# EAGLE design RPM_TFT2 (EAGLE 6.4)
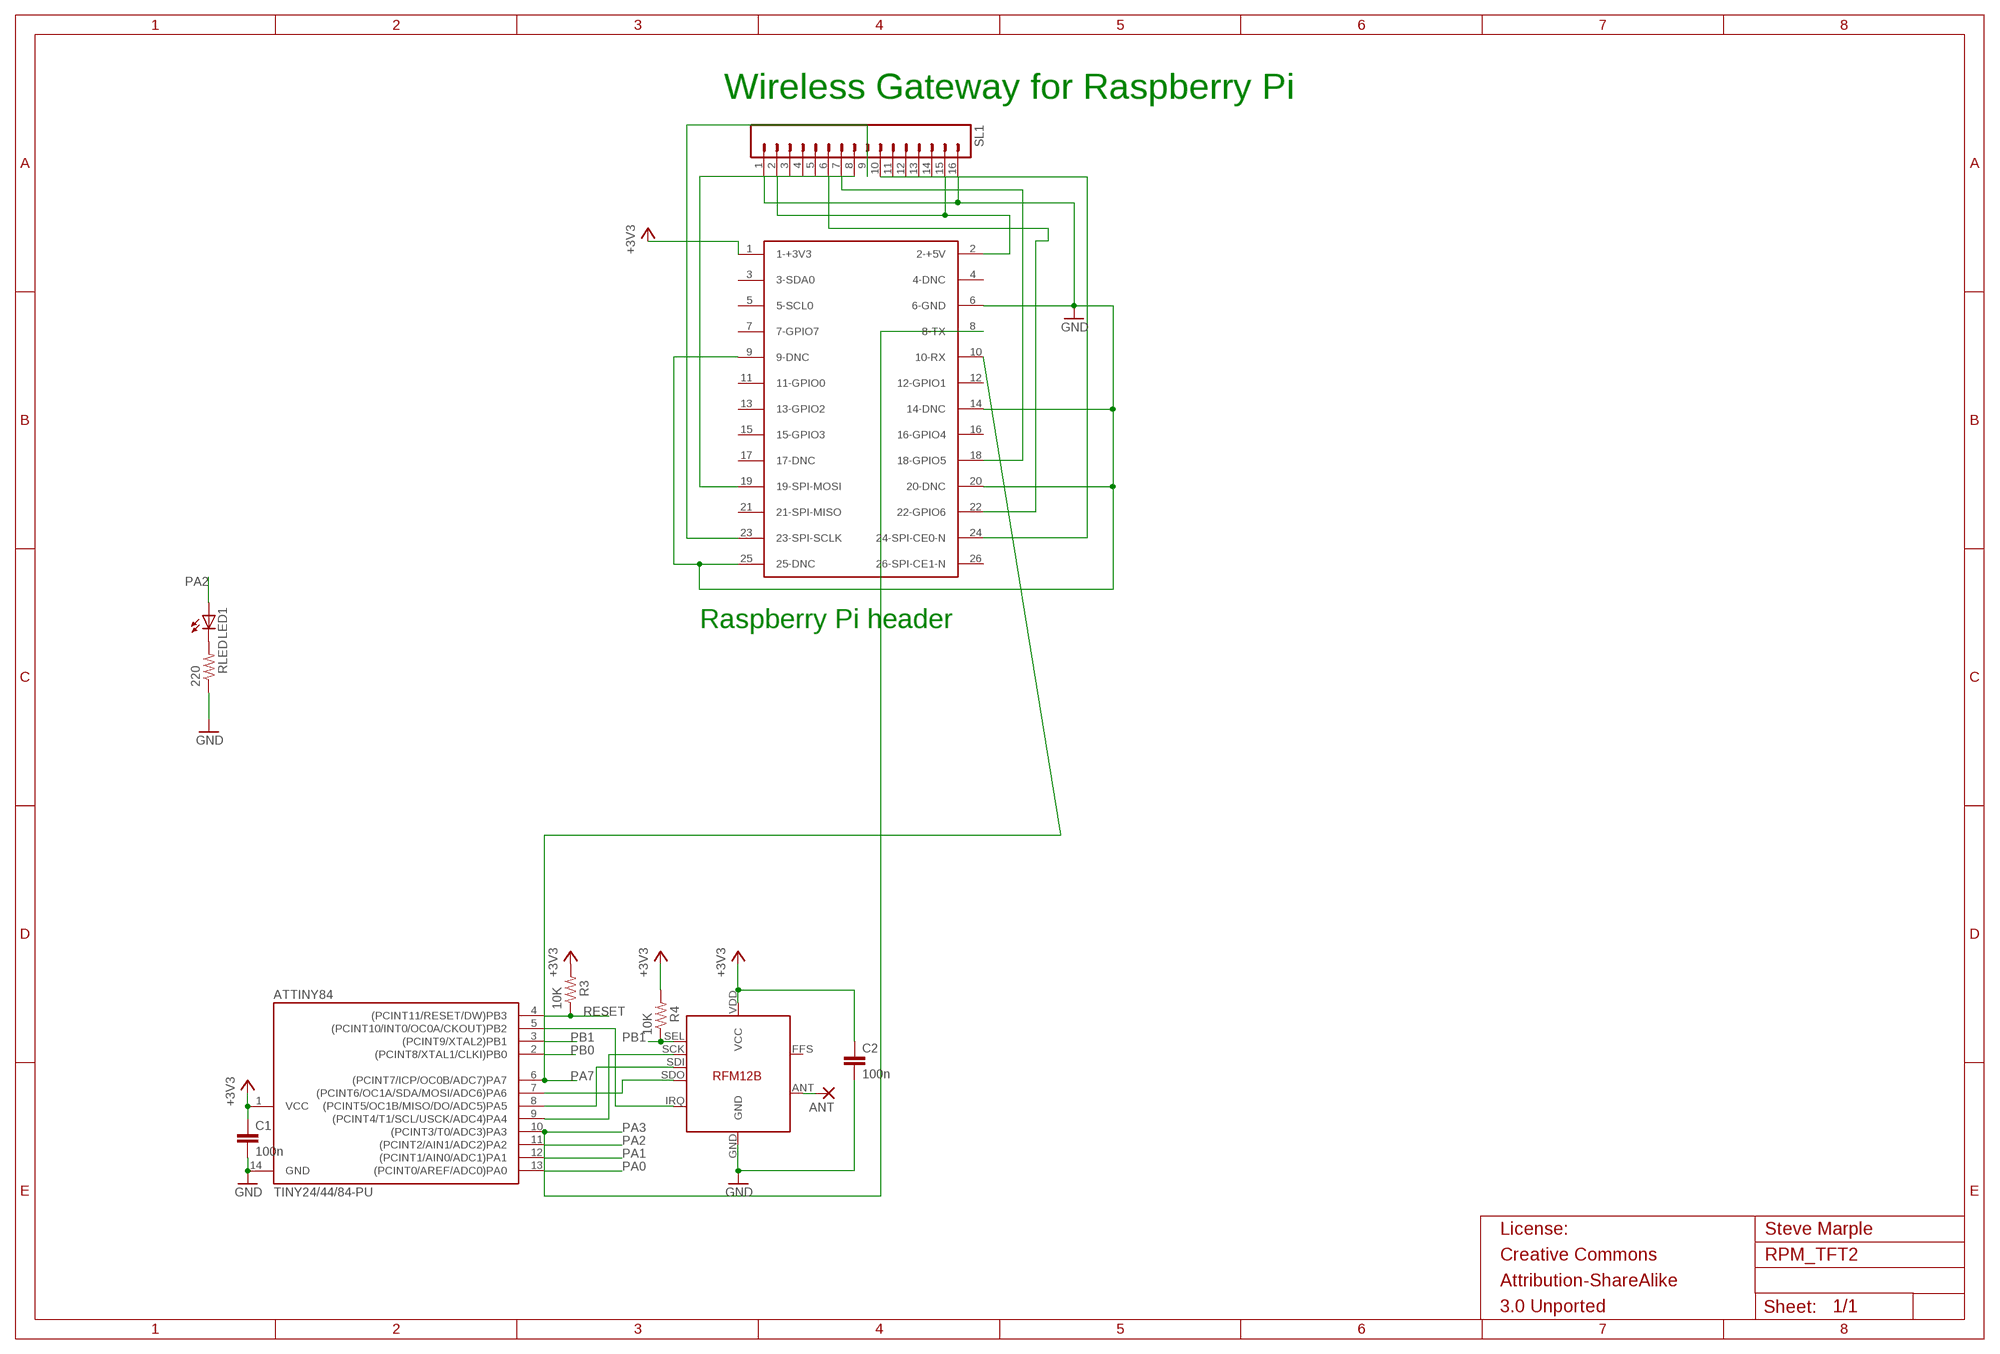
[diagram p0: schematic, sheet 1]

## Parts
ANT  1,6/0,8  [1,6/0,8]
ATTINY84  TINY24/44/84-PU  [DIL14]
C1  100n  C-EU025-024X044  [C025-024X044]
C2  100n  C-EU025-024X044  [C025-024X044]
LED1  LED5MM  [LED5MM]
R3  10K  RESISTORAXIAL-0.3  [AXIAL-0.3]
R4  10K  RESISTORAXIAL-0.3  [AXIAL-0.3]
RFM12B  RFM12B  [RFM12B]
RLED  220  RESISTORAXIAL-0.3  [AXIAL-0.3]
SL1  M16  [16P]
X1  P1A  RASPBERRY-PIHEADER  [RASPBERRY-PI-HEADER]

## Nets
+3V3 [power]: ATTINY84.1(VCC) C1.1 C2.1 R3.P$2 R4.P$2 RFM12B.VDD(VCC) X1.1(1-+3V3)
GND [power]: ATTINY84.14(GND) C1.2 C2.2 RFM12B.GND RLED.P$1 SL1.1 SL1.16 X1.6(6-GND) X1.9(9-DNC) X1.14(14-DNC) X1.20(20-DNC) X1.25(25-DNC)
MISO: ATTINY84.8((PCINT5/OC1B/MISO/DO/ADC5)PA5) RFM12B.SDI
MOSI: ATTINY84.7((PCINT6/OC1A/SDA/MOSI/ADC6)PA6) RFM12B.SDO
N$2: SL1.6 X1.22(22-GPIO6)
N$3: LED1.K(C) RLED.P$2
N$4: SL1.2 SL1.15 X1.2(2-+5V)
N$5: SL1.7 X1.18(18-GPIO5)
N$6 [power]: ANT.1(P) RFM12B.ANT
N$7: SL1.8 X1.19(19-SPI-MOSI)
N$8: SL1.9 X1.23(23-SPI-SCLK)
N$9: SL1.10 X1.24(24-SPI-CE0-N)
PA0: ATTINY84.13((PCINT0/AREF/ADC0)PA0)
PA1 [power]: ATTINY84.12((PCINT1/AIN0/ADC1)PA1)
PA2: ATTINY84.11((PCINT2/AIN1/ADC2)PA2) LED1.A
PA3: ATTINY84.10((PCINT3/T0/ADC3)PA3) X1.8(8-TX)
PA7: ATTINY84.6((PCINT7/ICP/OC0B/ADC7)PA7) X1.10(10-RX)
PB0: ATTINY84.2((PCINT8/XTAL1/CLKI)PB0)
PB1: ATTINY84.3((PCINT9/XTAL2)PB1) R4.P$1 RFM12B.SEL
PB2: ATTINY84.5((PCINT10/INT0/OC0A/CKOUT)PB2) RFM12B.IRQ
RESET: ATTINY84.4((PCINT11/RESET/DW)PB3) R3.P$1
SCK: ATTINY84.9((PCINT4/T1/SCL/USCK/ADC4)PA4) RFM12B.SCK
Unconnected: RFM12B.FFS SL1.3 SL1.4 SL1.5 SL1.11 SL1.12 SL1.13 SL1.14 X1.3(3-SDA0) X1.4(4-DNC) X1.5(5-SCL0) X1.7(7-GPIO7) X1.11(11-GPIO0) X1.12(12-GPIO1) X1.13(13-GPIO2) X1.15(15-GPIO3) X1.16(16-GPIO4) X1.17(17-DNC) X1.21(21-SPI-MISO) X1.26(26-SPI-CE1-N)

## Notes on the sheet
- Wireless Gateway for Raspberry Pi
- Raspberry Pi header
- License: | Steve Marple
- Creative Commons
- Attribution-ShareAlike
- 3.0 Unported

## Library data of the parts
ANT = JeeLabs:1,6/0,8: THROUGH-HOLE PAD
ATTINY84 = avr-7:TINY24/44/84
C1 C2 = rcl:C-EU: CAPACITOR, European symbol
LED1 = led:LED: LED OSRAM: - CHIPLED LG R971, LG N971, LY N971, LG Q971, LY Q971, LO R971, LY R971 LH N974, LH R974 LS Q976, LO Q976, LY Q976 LO Q996 - Hyper CHIPLED LW Q18S LB Q993, LB Q99A, LB R99A - SideLED LS A670, LO A670, LY A670, LG A670, LP A670 LB A673, LV A673, LT A673, LW A673 LH A674 LY A675 LS A676, LA A676, LO A676, LY A676, LW A676 LS A679, LY A679, LG A679 - Hyper Micro SIDELED® LS Y876, LA Y876, LO Y876, LY Y876 LT Y87S - SmartLED LW L88C, LW L88S LB L89C, LB L89S, LG L890 LS L89K, LO L89K, LY L89K LS L896, LA L896, LO L896, LY L896 - TOPLED LS T670, LO T670, LY T670, LG T670, LP T670 LSG T670, LSP T670, LSY T670, LOP T670, LYG T670 LG T671, LOG T671, LSG T671 LB T673, LV T673, LT T673, LW T673 LH T674 LS T676, LA T676, LO T676, LY T676, LB T676, LH T676, LSB T676, LW T676 LB T67C, LV T67C, LT T67C, LS T67K, LO T67K, LY T67K, LW E67C LS E67B, LA E67B, LO E67B, LY E67B, LB E67C, LV E67C, LT E67C LW T67C LS T679, LY T679, LG T679 LS T770, LO T770, LY T770, LG T770, LP T770 LB T773, LV T773, LT T773, LW T773 LH T774 LS E675, LA E675, LY E675, LS T675 LS T776, LA T776, LO T776, LY T776, LB T776 LHGB T686 LT T68C, LB T68C - Hyper Mini TOPLED® LB M676 - Mini TOPLED Santana® LG M470 LS M47K, LO M47K, LY M47K Source: http://www.osram.convergy.de LUXEON: - LUMILED® LXK2-PW12-R00, LXK2-PW12-S00, LXK2-PW14-U00, LXK2-PW14-V00 LXK2-PM12-R00, LXK2-PM12-S00, LXK2-PM14-U00 LXK2-PE12-Q00, LXK2-PE12-R00, LXK2-PE12-S00, LXK2-PE14-T00, LXK2-PE14-U00 LXK2-PB12-K00, LXK2-PB12-L00, LXK2-PB12-M00, LXK2-PB14-N00, LXK2-PB14-P00, LXK2-PB14-Q00 LXK2-PR12-L00, LXK2-PR12-M00, LXK2-PR14-Q00, LXK2-PR14-R00 LXK2-PD12-Q00, LXK2-PD12-R00, LXK2-PD12-S00 LXK2-PH12-R00, LXK2-PH12-S00 LXK2-PL12-P00, LXK2-PL12-Q00, LXK2-PL12-R00 Source: www.luxeon.com KINGBRIGHT: KA-3528ASYC Source: www.kingbright.com
R3 R4 RLED = SparkFun:RESISTOR: Resistor Basic schematic elements and footprints for 0603, 1206, and PTH resistors.
RFM12B = JeeLabs:RFM12B
SL1 = con-amp-quick:M16: AMP QUICK CONNECTOR; OC_FARNELL: unknown; OC_NEWARK: unknown
X1 = SteveMarple:RASPBERRY-PI: Raspberry Pi Board <http://www.raspberrypi.org/> Jacques Lagnel V1.0 (beta) 2012 Board dimension: Forum 3D model <http://www.raspberrypi.org/forum/general-discussion/mechanical-profile-3d-models?value=3d%20model&type=1&include=1&search=1&ret=all> The GPIO Connector (P1): http://elinux.org/RPi_Low-level_peripherals

## Net classes
0 default: width 0.254 mm, drill 0.254 mm, clearance 0.254 mm
1 power: width 0.305 mm, drill 0.305 mm, clearance 0.305 mm
2 5V: width 0.381 mm
3 antenna: width 0.61 mm

## Board
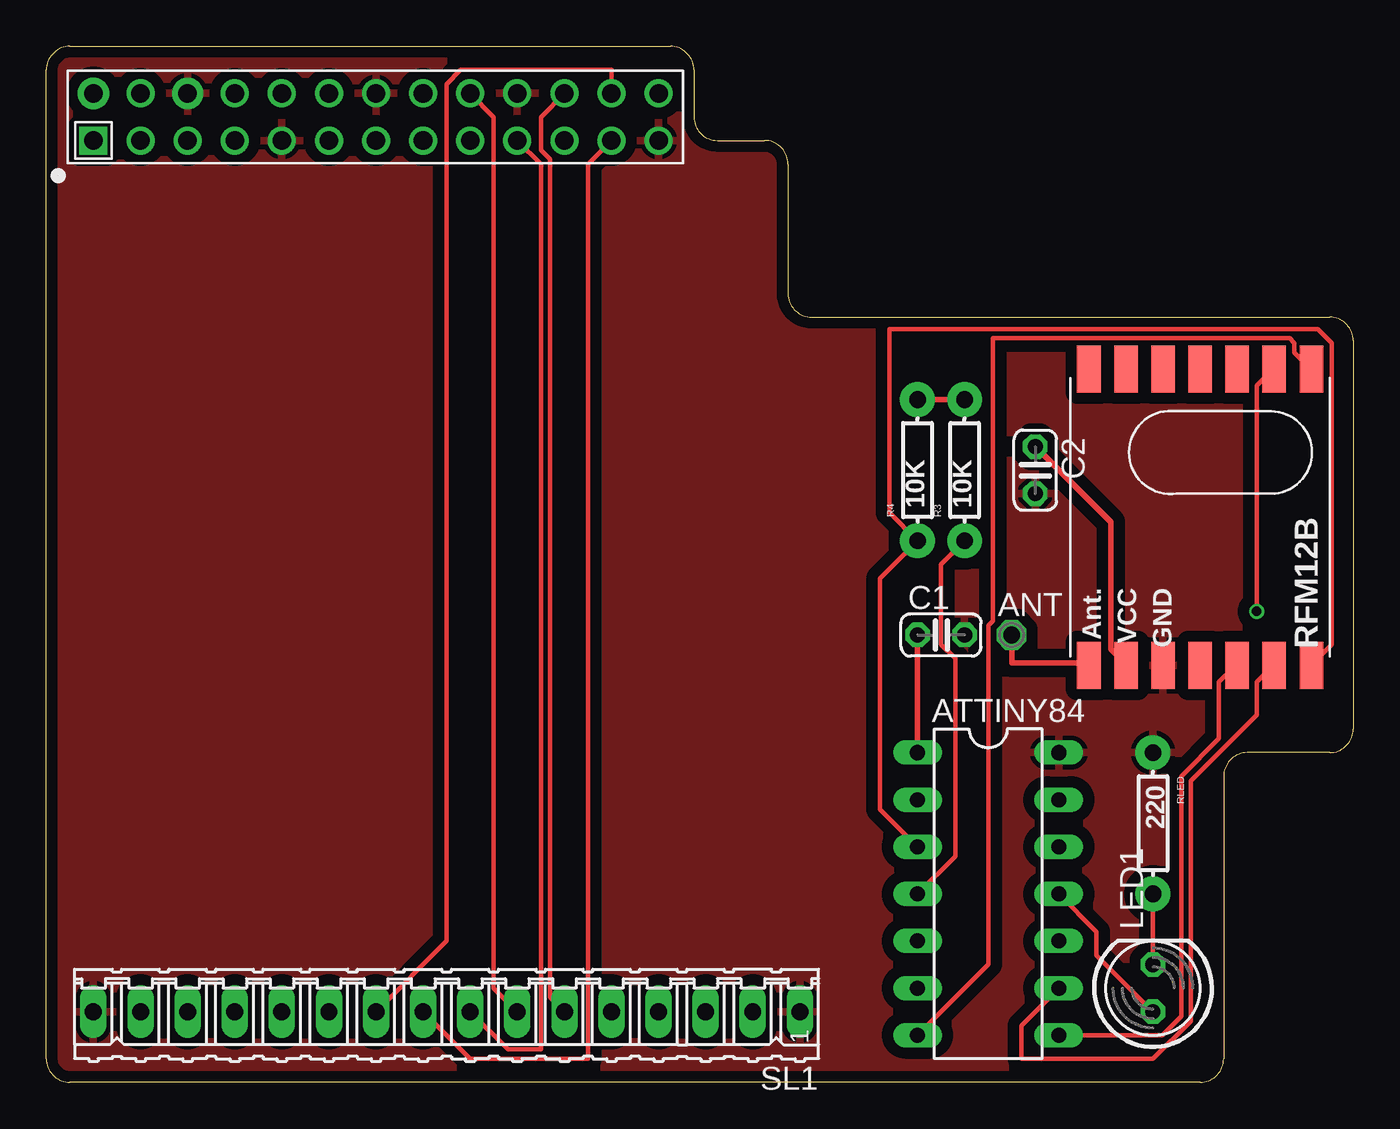
[diagram p1: board, top side]
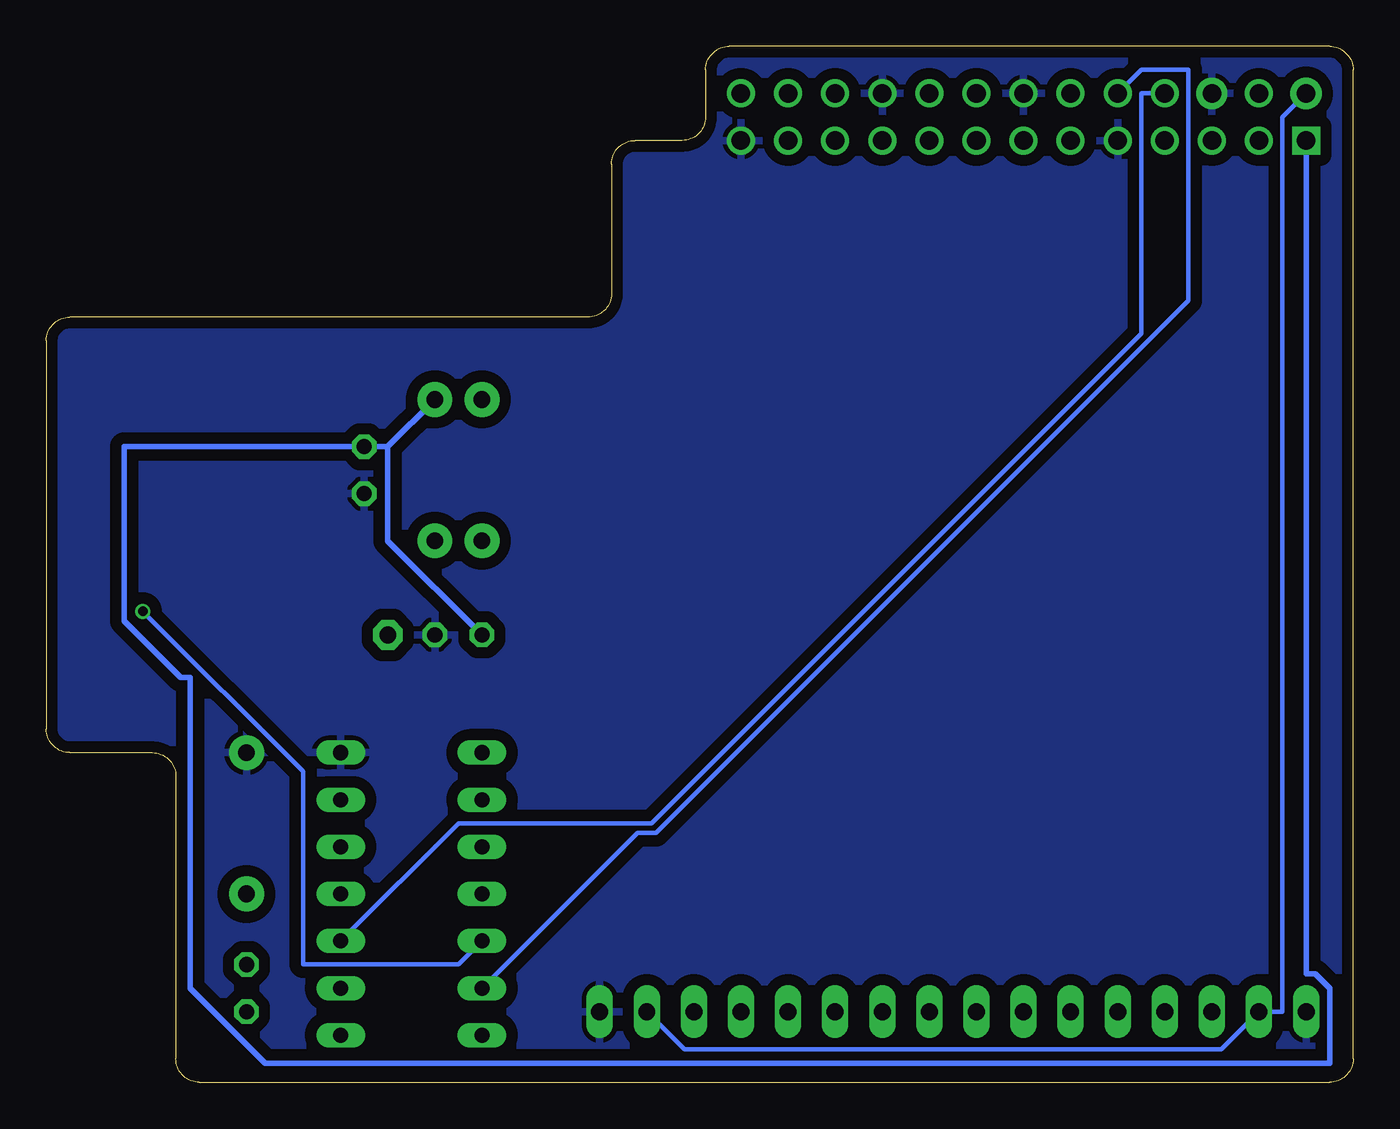
[diagram p2: board, bottom side, seen from below]

Size 70.48 x 55.88 mm. Coordinates in mm from the lower left corner, seen from the top.
Outline: 0,1.27 0,54.61 arc-90 1.27,55.88 33.66,55.88 arc-90 34.92,54.61 34.92,52.07 arc90 36.2,50.8 38.73,50.8 arc-90 40.01,49.53 40.01,42.55 arc90 41.27,41.27 69.22,41.27 arc-90 70.48,40.01 70.48,19.05 arc-90 69.22,17.78 64.77,17.78 arc90 63.5,16.51 63.5,1.27 arc-90 62.23,0 1.27,0 arc-90 0,1.27
Copper layers (1*16): Top 0.035mm / dielectric 1.5mm / Bottom 0.035mm
Design rules "EagleRules": minimum track width 7mil, minimum drill 12mil, track to track 7mil, track to pad 7mil, pad to pad 7mil, via to via 7mil, smd to smd 0mil, copper to edge 20mil, drill to drill 10mil, minimum pad ring 10mil, minimum via ring 6mil, stop-mask expansion 2mil, vias tented up to drill 25mil, thermal gap 10mil

### Footprints (pad centres in the part's own frame; a part is rotated, then mirrored left to right if it is on the bottom)
1,6/0,8 = drill 0.9 pad 1.6 octagon: 1 0,0
DIL14 = drill 0.813 long: 1 -7.62,-3.81; 2 -5.08,-3.81; 3 -2.54,-3.81; 4 0,-3.81; 5 2.54,-3.81; 6 5.08,-3.81; 7 7.62,-3.81; 8 7.62,3.81; 9 5.08,3.81; 10 2.54,3.81; 11 0,3.81; 12 -2.54,3.81; 13 -5.08,3.81; 14 -7.62,3.81
C025-024X044 = drill 0.813 octagon: 1 -1.27,0; 2 1.27,0
LED5MM = drill 0.813 octagon: A -1.27,0; K 1.27,0
AXIAL-0.3 = drill 0.9 pad 1.88: P$1 -3.81,0; P$2 3.81,0
RFM12B = smd 2.54 x 1.27: ANT 8,-6; FFS -8,2; GND 8,-2; IRQ -8,4; P$8 -8,0; P$9 -8,-2; P$10 -8,-4; P$12 -8,-6; P$16 8,0; SCK 8,4; SDI 8,2; SDO -8,6; SEL 8,6; VDD 8,-4
16P = drill 0.914 long: 1 -19.05,0; 2 -16.51,0; 3 -13.97,0; 4 -11.43,0; 5 -8.89,0; 6 -6.35,0; 7 -3.81,0; 8 -1.27,0; 9 1.27,0; 10 3.81,0; 11 6.35,0; 12 8.89,0; 13 11.43,0; 14 13.97,0; 15 16.51,0; 16 19.05,0
RASPBERRY-PI-HEADER = drill 1 square: 1 0,0 | drill 1 pad 1.676: 2 0,2.54; 6 5.08,2.54 | drill 1: 3 2.54,0; 4 2.54,2.54; 5 5.08,0; 7 7.62,0; 8 7.62,2.54; 9 10.16,0; 10 10.16,2.54; 11 12.7,0; 12 12.7,2.54; 13 15.24,0; 14 15.24,2.54; 15 17.78,0; 16 17.78,2.54; 17 20.32,0; 18 20.32,2.54; 19 22.86,0; 20 22.86,2.54; 21 25.4,0; 22 25.4,2.54; 23 27.94,0; 24 27.94,2.54; 25 30.48,0; 26 30.48,2.54

### Placement (x,y rotation side)
ANT  52.07,24.13 0 top
ATTINY84  50.8,10.16 270 top
C1  48.26,24.13 0 top
C2  53.34,33.02 270 top
LED1  59.69,5.08 90 top
R3  49.53,33.02 90 top
R4  46.99,33.02 90 top
RFM12B  62.23,30.48 270 top
RLED  59.69,13.97 270 top
SL1  21.59,3.81 180 top
X1  2.54,50.8 0 top

### Tracks (layer width: path | path; a pad name or v marks a point on that pad's centre or on a via)
+3V3
  Top 0.305: C1.1 ATTINY84.1 | R3.P$2 R4.P$2 | C2.1 57.4,30.23 57.4,23.37 58.17,22.61 RFM12B.VDD
  Bottom 0.305: X1.1 2.54,5.84 2.03,5.84 1.27,5.08 1.27,1.02 58.67,1.02 62.74,5.08 62.74,21.84 63.25,21.84 66.29,24.89 66.29,34.29 C2.1 52.07,34.29 | 52.07,34.29 R3.P$2 | C1.1 52.07,29.21 52.07,34.29
GND
  pour Bottom (isolate 0.61): -1.27,-1.27 -1.27,57.15 72.39,57.15 72.39,-1.27
  pour Top (isolate 0.61): -1.27,-1.27 -1.27,57.15 72.39,57.15 72.39,-1.27
MISO
  Top 0.254: ATTINY84.8 60.2,2.54 61.21,3.56 61.21,16.51 63.25,18.54 63.25,21.59 64.01,22.35 RFM12B.SDI
MOSI
  Top 0.254: ATTINY84.7 50.8,6.35 50.8,24.64 51.05,24.89 51.05,40.13 67.06,40.13 67.31,39.88 67.31,39.37 68.07,38.61 RFM12B.SDO
N$2
  Top 0.254: SL1.6 27.18,4.57 27.18,49.78 26.67,50.29 26.67,52.07 X1.22
N$3
  Top 0.254: RLED.P$2 LED1.K
N$4
  Bottom 0.254: SL1.2 36.07,1.78 7.11,1.78 SL1.15 3.81,3.81 3.81,52.07 X1.2
N$5
  Top 0.254: SL1.7 24.13,5.08 24.13,52.07 X1.18
N$6
  Top 0.305: ANT.1 52.07,22.61 56.13,22.61 RFM12B.ANT
N$7
  Top 0.254: SL1.8 24.89,1.78 26.67,1.78 26.67,49.53 X1.19
N$8
  Top 0.254: SL1.9 22.86,1.27 29.21,1.27 29.21,49.53 X1.23
N$9
  Top 0.254: SL1.10 21.59,7.62 21.59,53.85 22.35,54.61 30.48,54.61 X1.24
PA2
  Top 0.254: LED1.A 56.64,6.86 56.64,8.13 ATTINY84.11
PA3
  Bottom 0.254: ATTINY84.10 48.26,13.97 37.85,13.97 11.43,40.39 11.43,53.34 X1.8
PA7
  Bottom 0.254: ATTINY84.6 38.61,13.46 37.59,13.46 8.89,42.16 8.89,54.61 11.43,54.61 X1.10
PB1
  Top 0.254: RFM12B.SEL 68.33,22.61 69.34,23.62 69.34,39.88 68.58,40.64 45.47,40.64 45.47,30.73 R4.P$1 44.96,27.18 44.96,14.73 ATTINY84.3
PB2  (via drill 0.51)
  Top 0.254: v65.28,25.4 65.28,37.59 66.04,38.35 RFM12B.IRQ
  Bottom 0.254: v65.28,25.4 56.64,16.76 56.64,6.35 48.26,6.35 ATTINY84.5
RESET
  Top 0.254: ATTINY84.4 49.02,12.19 49.02,22.86 48.26,23.62 48.26,27.94 R3.P$1
SCK
  Top 0.254: ATTINY84.9 52.58,3.05 52.58,1.27 59.69,1.27 61.72,3.3 61.72,16.26 65.28,19.81 65.28,21.59 66.04,22.35 RFM12B.SCK
(copper drawn outside any net)
  shapes: Bottom area x1